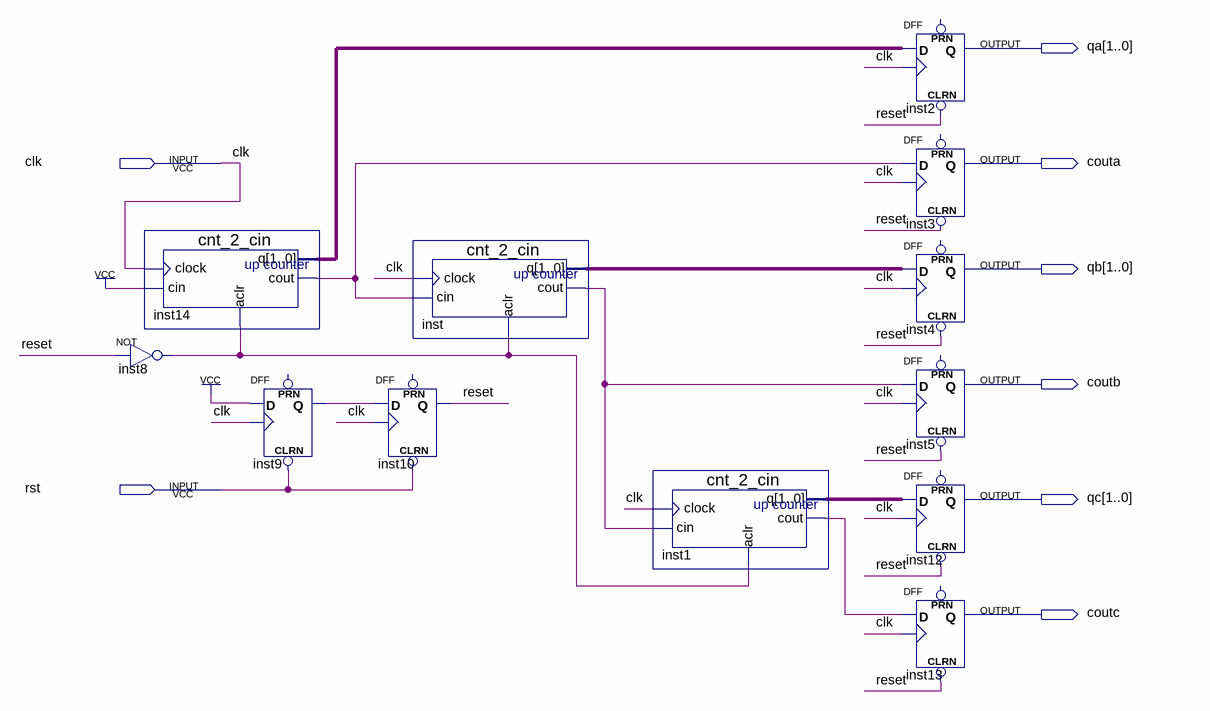
[diagram p0: schematic sheet]
// Quartus schematic lab4_three.bdf as structural Verilog: 12 symbols, 8 pins
module lab4_three (
  input  clk,
  input  rst,
  output [1:0] qa,
  output couta,
  output [1:0] qb,
  output coutb,
  output [1:0] qc,
  output coutc
);

  wire inst1_cout, inst8_out, inst9_q, inst14_cout, inst_cout, reset;
  wire [1:0] inst1_q, inst14_q, inst_q;

  cnt_2_cin inst14 (.clock(clk), .cin(1'b1), .aclr(inst8_out), .cout(inst14_cout), .q(inst14_q));
  not inst8 (inst8_out, reset);
  DFF inst9 (.CLRN(rst), .CLK(clk), .D(1'b1), .Q(inst9_q));  // open: PRN
  DFF inst10 (.CLRN(rst), .CLK(clk), .D(inst9_q), .Q(reset));  // open: PRN
  cnt_2_cin inst (.clock(clk), .cin(inst14_cout), .aclr(inst8_out), .cout(inst_cout), .q(inst_q));
  cnt_2_cin inst1 (.clock(clk), .cin(inst_cout), .aclr(inst8_out), .cout(inst1_cout), .q(inst1_q));
  DFF inst2[1:0] (.CLRN(reset), .CLK(clk), .D(inst14_q), .Q(qa));  // open: PRN
  DFF inst3 (.CLRN(reset), .CLK(clk), .D(inst14_cout), .Q(couta));  // open: PRN
  DFF inst4[1:0] (.CLRN(reset), .CLK(clk), .D(inst_q), .Q(qb));  // open: PRN
  DFF inst5 (.CLRN(reset), .CLK(clk), .D(inst_cout), .Q(coutb));  // open: PRN
  DFF inst12[1:0] (.CLRN(reset), .CLK(clk), .D(inst1_q), .Q(qc));  // open: PRN
  DFF inst13 (.CLRN(reset), .CLK(clk), .D(inst1_cout), .Q(coutc));  // open: PRN
endmodule
